# Altium schematic sheet МК.SchDoc
size 840 x 594 mm; SheetNumber: 2; SheetTotal: 5
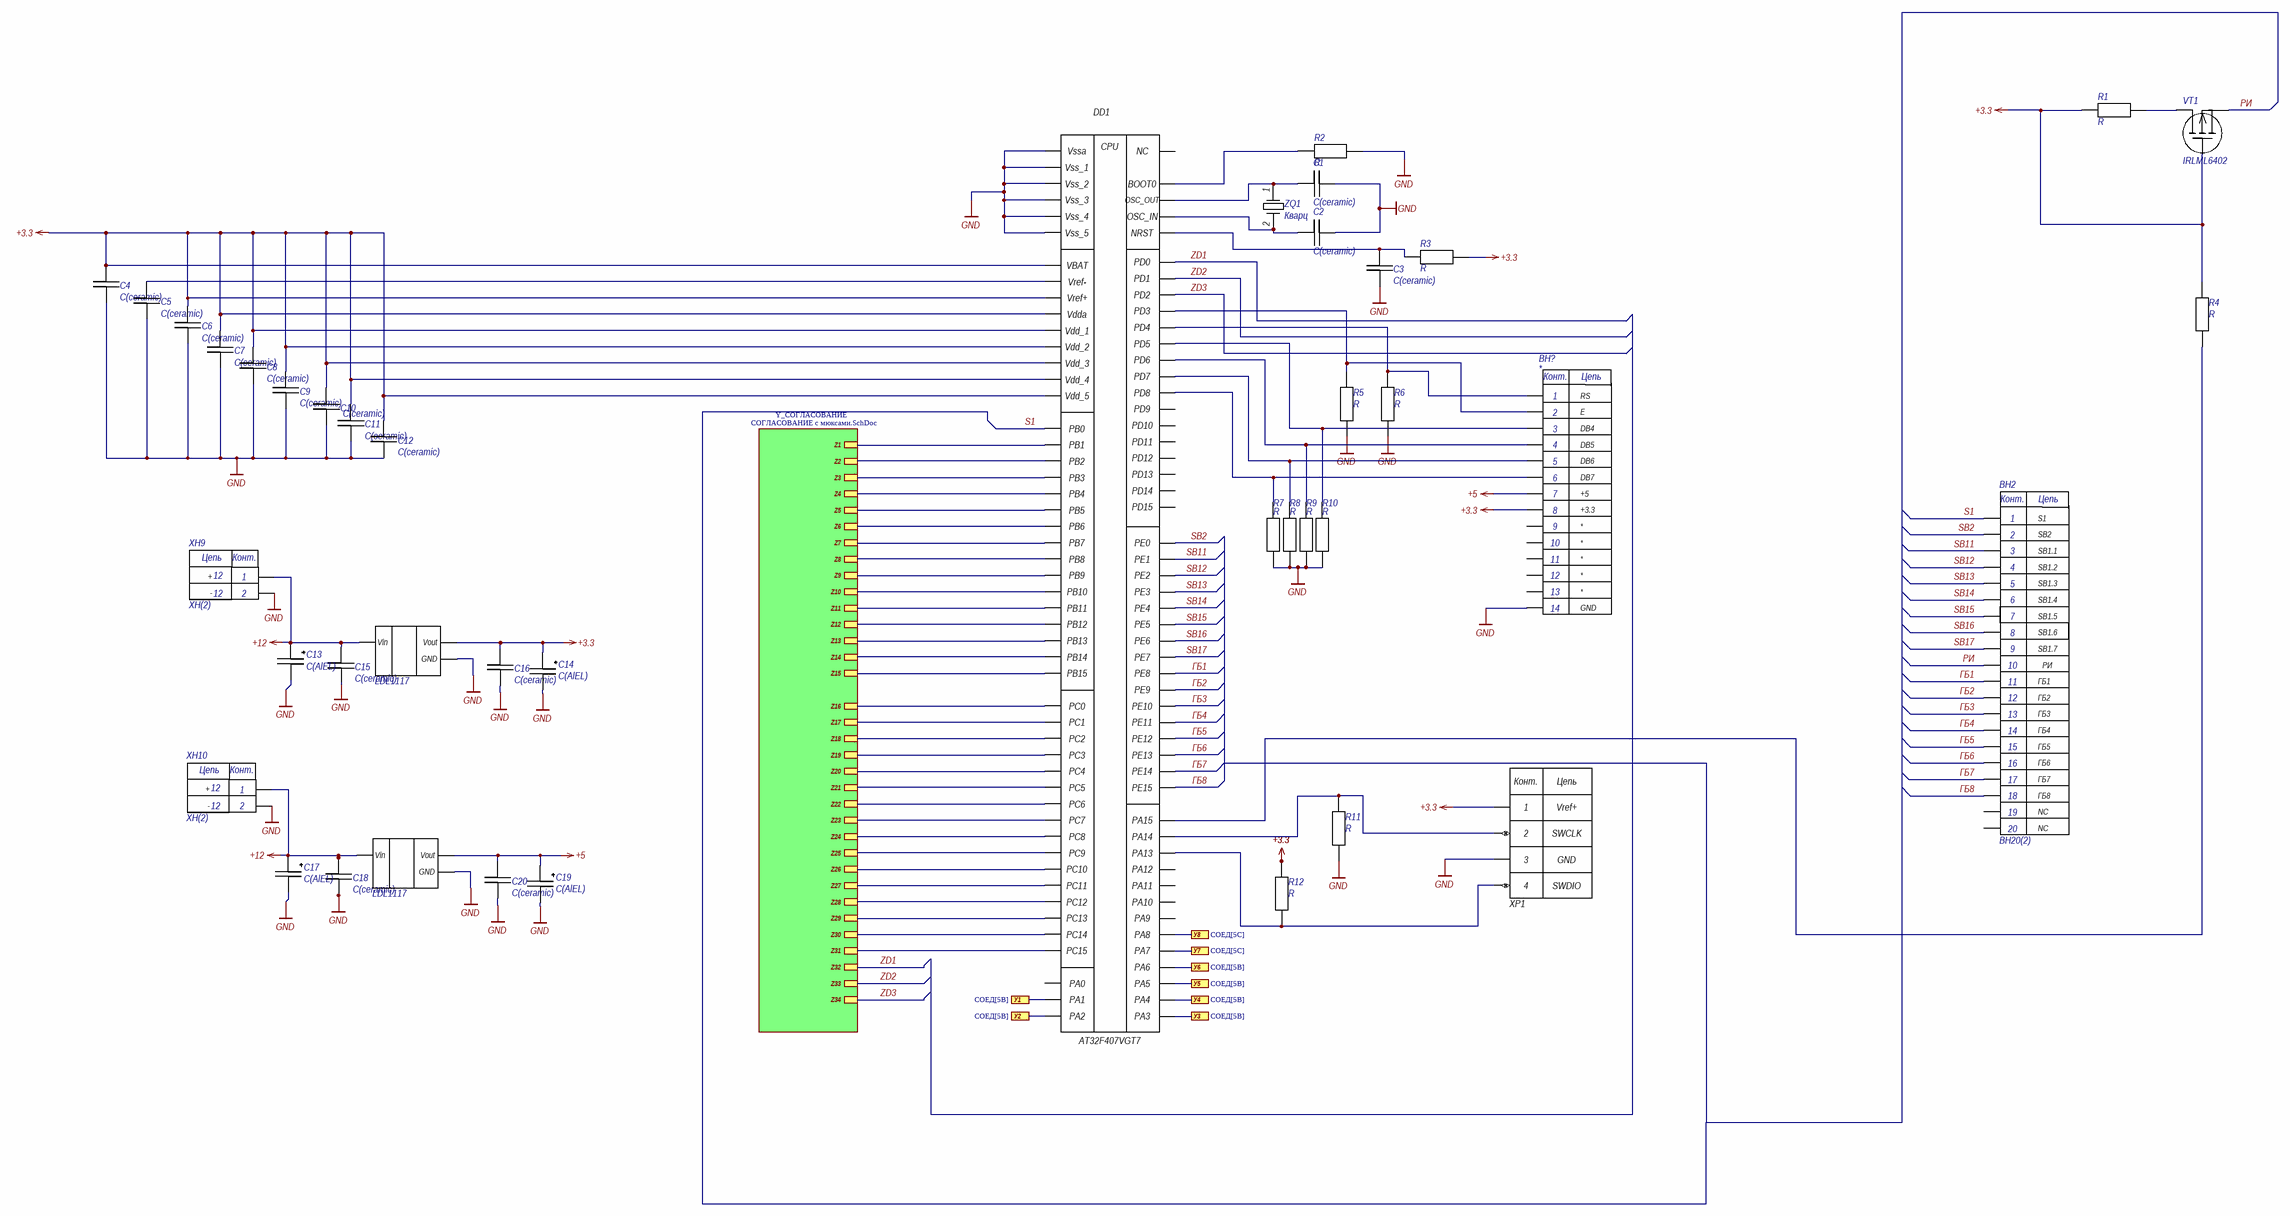
[diagram p0: МК.SchDoc]

## Parts
BH2  BH20(2)  [IDC20]
BH?  *  [BH-14 (DS1013-14S) (IDC-14MS)]
C1  C(ceramic)  [C(ceramic)]
C2  C(ceramic)  [C(ceramic)]
C3  C(ceramic)  [C(ceramic)]
C4  C(ceramic)  [C(ceramic)]
C5  C(ceramic)  [C(ceramic)]
C6  C(ceramic)  [C(ceramic)]
C7  C(ceramic)  [C(ceramic)]
C8  C(ceramic)  [C(ceramic)]
C9  C(ceramic)  [C(ceramic)]
C10  C(ceramic)  [C(ceramic)]
C11  C(ceramic)  [C(ceramic)]
C12  C(ceramic)  [C(ceramic)]
C13  C(AlEL)  [C(AlEL)]
C14  C(AlEL)  [C(AlEL)]
C15  C(ceramic)  [C(ceramic)]
C16  C(ceramic)  [C(ceramic)]
C17  C(AlEL)  [C(AlEL)]
C18  C(ceramic)  [C(ceramic)]
C19  C(AlEL)  [C(AlEL)]
C20  C(ceramic)  [C(ceramic)]
DD1  AT32F407VGT7  [Микроконтроллер AT32F407VGT7_LQFP-100]
DD2  LDL1117  [LDL1117]
DD3  LDL1117  [LDL1117]
R1  R  [R]
R2  R  [R]
R3  R  [R]
R4  R  [R]
R5  R  [R]
R6  R  [R]
R7  R  [R]
R8  R  [R]
R9  R  [R]
R10  R  [R]
R11  R  [R]
R12  R  [R]
VT1  IRLML6402  [BC847(IRLML6402)]
XH9  ХН(2)  [ХН(2)]
XH10  ХН(2)  [ХН(2)]
XP1  Обозначение при заказе  [PLS-4]  (value not drawn)
ZQ1  Кварц  [KX-38 32.768 KHZ]

## Sub-sheets
Y_СОГЛАСОВАНИЕ = СОГЛАСОВАНИЕ с мюксами.SchDoc: Z1, Z2, Z3, Z4, Z5, Z6, Z7, Z8, Z9, Z10, Z11, Z12, Z13, Z14, Z15, Z16, Z17, Z18, Z19, Z20, Z21, Z22, Z23, Z24, Z25, Z26, Z27, Z28, Z29, Z30, Z31, Z32, Z33, Z34

## Ports
У1 (see СОЕД[5B]), У2 (see СОЕД[5B]), У3 (see СОЕД[5B]), У4 (see СОЕД[5B]), У5 (see СОЕД[5B]), У6 (see СОЕД[5B]), У7 (see СОЕД[5C]), У8 (see СОЕД[5C])

## Nets
+3.3: BH?.8(+3.3) C4.2 C6.2 C7.2 C8.2 C9.2 C10.2 C11.2 C12.2 C14.1 C16.2 DD1.6(VBAT) DD1.11(Vdd_5) DD1.21(Vref+) DD1.22(Vdda) DD1.28(Vdd_4) DD1.50(Vdd_1) DD1.75(Vdd_2) DD1.100(Vdd_3) DD2.2(Vout) R1.2 R3.1 R4.2 R12.1 VT1.1 XP1.1(Uпит)
+5: BH?.7(+5) C19.1 C20.2 DD3.2(Vout)
+12: C13.1 C15.2 C17.1 C18.2 DD2.3(Vin) DD3.3(Vin) XH9.1(+) XH10.1(+)
GND: BH?.14(GND) C1.2 C2.2 C3.1 C4.1 C5.1 C6.1 C7.1 C8.1 C9.1 C10.1 C11.1 C12.1 C13.2 C14.2 C15.1 C16.1 C17.2 C18.1 C19.2 C20.1 DD1.10(Vss_5) DD1.19(Vssa) DD1.27(Vss_4) DD1.49(Vss_1) DD1.74(Vss_2) DD1.99(Vss_3) DD2.1(GND) DD3.1(GND) R2.2 R5.1 R6.1 R7.2 R8.2 R9.2 R10.2 R11.1 XH9.2(-) XH10.2(-) XP1.3(GND)
S1: BH2.1(S1) DD1.35(PB0)
SB2: BH2.2(SB2) DD1.97(PE0)
SB11: BH2.3(SB1.1) DD1.98(PE1)
SB12: BH2.4(SB1.2) DD1.1(PE2)
SB13: BH2.5(SB1.3) DD1.2(PE3)
SB14: BH2.6(SB1.4) DD1.3(PE4)
SB15: BH2.7(SB1.5) DD1.4(PE5)
SB16: BH2.8(SB1.6) DD1.5(PE6)
SB17: BH2.9(SB1.7) DD1.38(PE7)
ZD1: DD1.81(PD0) ; sheet Y_СОГЛАСОВАНИЕ/Z32
ZD2: DD1.82(PD1) ; sheet Y_СОГЛАСОВАНИЕ/Z33
ZD3: DD1.83(PD2) ; sheet Y_СОГЛАСОВАНИЕ/Z34
ГБ1: BH2.11(ГБ1) DD1.39(PE8)
ГБ2: BH2.12(ГБ2) DD1.40(PE9)
ГБ3: BH2.13(ГБ3) DD1.41(PE10)
ГБ4: BH2.14(ГБ4) DD1.42(PE11)
ГБ5: BH2.15(ГБ5) DD1.43(PE12)
ГБ6: BH2.16(ГБ6) DD1.44(PE13)
ГБ7: BH2.17(ГБ7) DD1.45(PE14)
ГБ8: BH2.18(ГБ8) DD1.46(PE15)
РИ: BH2.10(РИ) VT1.2
У1: DD1.24(PA1) ; port У1
У2: DD1.25(PA2) ; port У2
У3: DD1.26(PA3) ; port У3
У4: DD1.29(PA4) ; port У4
У5: DD1.30(PA5) ; port У5
У6: DD1.31(PA6) ; port У6
У7: DD1.32(PA7) ; port У7
У8: DD1.67(PA8) ; port У8
NetBH?_1: BH?.1(RS) DD1.85(PD4) R6.2
NetBH?_2: BH?.2(E) DD1.84(PD3) R5.2
NetBH?_3: BH?.3(DB4) DD1.86(PD5) R10.1
NetBH?_4: BH?.4(DB5) DD1.87(PD6) R9.1
NetBH?_5: BH?.5(DB6) DD1.88(PD7) R8.1
NetBH?_6: BH?.6(DB7) DD1.55(PD8) R7.1
NetC1_1: C1.1 DD1.13(OSC_OUT) ZQ1.1
NetC2_1: C2.1 DD1.12(OSC_IN) ZQ1.2
NetC3_2: C3.2 DD1.14(NRST) R3.2
NetC5_2: C5.2 DD1.20(Vref-)
NetDD1_7: DD1.7(PC13) ; sheet Y_СОГЛАСОВАНИЕ/Z29
NetDD1_8: DD1.8(PC14) ; sheet Y_СОГЛАСОВАНИЕ/Z30
NetDD1_9: DD1.9(PC15) ; sheet Y_СОГЛАСОВАНИЕ/Z31
NetDD1_15: DD1.15(PC0) ; sheet Y_СОГЛАСОВАНИЕ/Z16
NetDD1_16: DD1.16(PC1) ; sheet Y_СОГЛАСОВАНИЕ/Z17
NetDD1_17: DD1.17(PC2) ; sheet Y_СОГЛАСОВАНИЕ/Z18
NetDD1_18: DD1.18(PC3) ; sheet Y_СОГЛАСОВАНИЕ/Z19
NetDD1_33: DD1.33(PC4) ; sheet Y_СОГЛАСОВАНИЕ/Z20
NetDD1_34: DD1.34(PC4) ; sheet Y_СОГЛАСОВАНИЕ/Z21
NetDD1_36: DD1.36(PB1) ; sheet Y_СОГЛАСОВАНИЕ/Z1
NetDD1_37: DD1.37(PB2) ; sheet Y_СОГЛАСОВАНИЕ/Z2
NetDD1_47: DD1.47(PB10) ; sheet Y_СОГЛАСОВАНИЕ/Z10
NetDD1_48: DD1.48(PB11) ; sheet Y_СОГЛАСОВАНИЕ/Z11
NetDD1_51: DD1.51(PB12) ; sheet Y_СОГЛАСОВАНИЕ/Z12
NetDD1_52: DD1.52(PB13) ; sheet Y_СОГЛАСОВАНИЕ/Z13
NetDD1_53: DD1.53(PB14) ; sheet Y_СОГЛАСОВАНИЕ/Z14
NetDD1_54: DD1.54(PB15) ; sheet Y_СОГЛАСОВАНИЕ/Z15
NetDD1_63: DD1.63(PC6) ; sheet Y_СОГЛАСОВАНИЕ/Z22
NetDD1_64: DD1.64(PC7) ; sheet Y_СОГЛАСОВАНИЕ/Z23
NetDD1_65: DD1.65(PC8) ; sheet Y_СОГЛАСОВАНИЕ/Z24
NetDD1_66: DD1.66(PC9) ; sheet Y_СОГЛАСОВАНИЕ/Z25
NetDD1_72: DD1.72(PA13) R12.2 XP1.4(SWDIO)
NetDD1_76: DD1.76(PA14) R11.2 XP1.2(SWCLK)
NetDD1_77: DD1.77(PA15) R4.1
NetDD1_78: DD1.78(PC10) ; sheet Y_СОГЛАСОВАНИЕ/Z26
NetDD1_79: DD1.79(PC11) ; sheet Y_СОГЛАСОВАНИЕ/Z27
NetDD1_80: DD1.80(PC12) ; sheet Y_СОГЛАСОВАНИЕ/Z28
NetDD1_89: DD1.89(PB3) ; sheet Y_СОГЛАСОВАНИЕ/Z3
NetDD1_90: DD1.90(PB4) ; sheet Y_СОГЛАСОВАНИЕ/Z4
NetDD1_91: DD1.91(PB5) ; sheet Y_СОГЛАСОВАНИЕ/Z5
NetDD1_92: DD1.92(PB6) ; sheet Y_СОГЛАСОВАНИЕ/Z6
NetDD1_93: DD1.93(PB7) ; sheet Y_СОГЛАСОВАНИЕ/Z7
NetDD1_94: DD1.94(BOOT0) R2.1
NetDD1_95: DD1.95(PB8) ; sheet Y_СОГЛАСОВАНИЕ/Z8
NetDD1_96: DD1.96(PB9) ; sheet Y_СОГЛАСОВАНИЕ/Z9
NetR1_1: R1.1 VT1.3

Not connected (* = marked no-connect by the designer): BH2 19(NC) 20(NC); BH? 9(*) 10(*) 11(*) 12(*) 13(*); DD1 23(PA0) 56(PD9) 57(PD10) 58(PD11) 59(PD12) 60(PD13) 61(PD14) 62(PD15) 68(PA9) 69(PA10) 70(PA11) 71(PA12) 73(NC)

## Notes on the sheet
- 12
- Перв. примен.
- Справ. №
- Подп. дата
- Инв. № дубл.
- Взам. инв. №
- Подп. и дата
- Изм.
- Разраб.
- Лист
- № докум.
- Подп.
- Дата
- Лит.
- Масса
- Масштаб
- Пров.
- Т.контр.
- Листов
- Инв. № подл.
- Н.контр.
- Утв.
- ALTIUM GOSTBOM2.0 KEV
- Файл:
- Копировал
- Формат А1
- (in symbol AT32F407) CPU; PC5
- (in symbol BH14(3)) Конт.; Цепь
- (in symbol BH20(2)) Конт.; Цепь
- (in symbol PLS-4) Конт.; Цепь; Vref+
- (in symbol ХН(2)) Цепь; Конт.

## Library data of the parts
BH? = BH14(3)
C1-C12 C15 C16 C18 C20 = C(ceramic): SMD
C13 C14 C17 C19 = C(AlEL): Электролит
DD1 = AT32F407: МК
DD2 DD3 = LDL1117: Стабилизатор
R1-R12 = R: SMD
VT1 = IRLML6402: Транзистор
XP1 = PLS-4: Штырьки
ZQ1 = KX-38 32.768 KHZ